# Altium schematic sheet ETROC_Power.SchDoc: ETROC Power
size A; DocumentNumber: 5; SheetNumber: 5; SheetTotal: 5
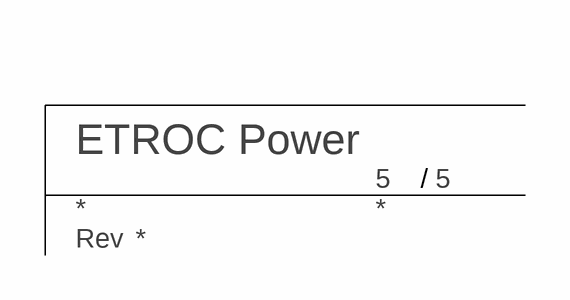
[diagram p0: ETROC_Power.SchDoc]

## Parts
TBLOCK?  BU Title block  (value not drawn)  (graphical)

## Notes on the sheet
- (in symbol TITLE_BLOCK_BU) /; Rev

## Library data of the parts
TBLOCK? = TITLE_BLOCK_BU